# Altium schematic sheet main.SchDoc
size A4; SheetNumber: 1
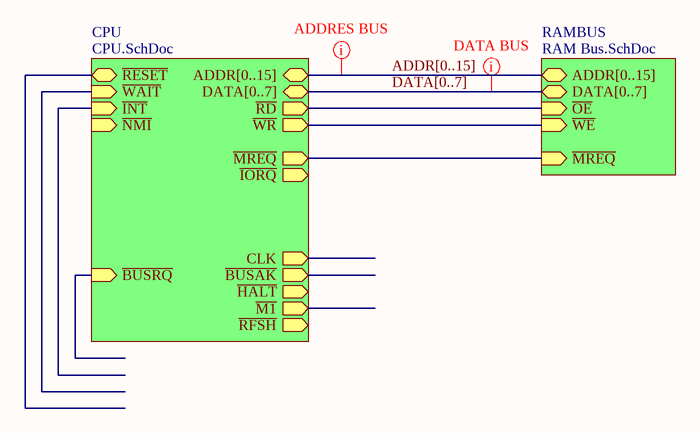
[diagram p0: main.SchDoc]

## Sub-sheets
CPU = CPU.SchDoc: ADDR[0..15] (bidir), DATA[0..7] (bidir), ~{M1} (out), ~{MREQ} (out), ~{IORQ} (out), ~{RD} (out), ~{WR} (out), ~{RFSH} (out), ~{WAIT} (in), ~{INT} (in), ~{BUSRQ} (in), ~{BUSAK} (out), ~{NMI} (in), ~{RESET} (bidir), ~{HALT} (out), CLK (out)
RAMBUS = RAM Bus.SchDoc: ~{OE} (in), ~{WE} (in), DATA[0..7] (bidir), ADDR[0..15] (bidir), ~{MREQ} (in)

## Nets
(unnamed): sheet CPU/~{MREQ}, sheet RAMBUS/~{MREQ}
(unnamed): sheet CPU/~{RD}, sheet RAMBUS/~{OE}
(unnamed): sheet CPU/~{WR}, sheet RAMBUS/~{WE}

## Buses and harness runs
bus ADDR[0..15] = sheet CPU/ADDR[0..15] = sheet RAMBUS/ADDR[0..15]
bus DATA[0..7] = sheet CPU/DATA[0..7] = sheet RAMBUS/DATA[0..7]

## Layout directives
net class ADDRES BUS: (no net found under the mark)
net class DATA BUS: (no net found under the mark)